# Altium schematic sheet VCU_Schematic.SchDoc
size A4; DocumentNumber: 4; SheetNumber: 4; SheetTotal: 8
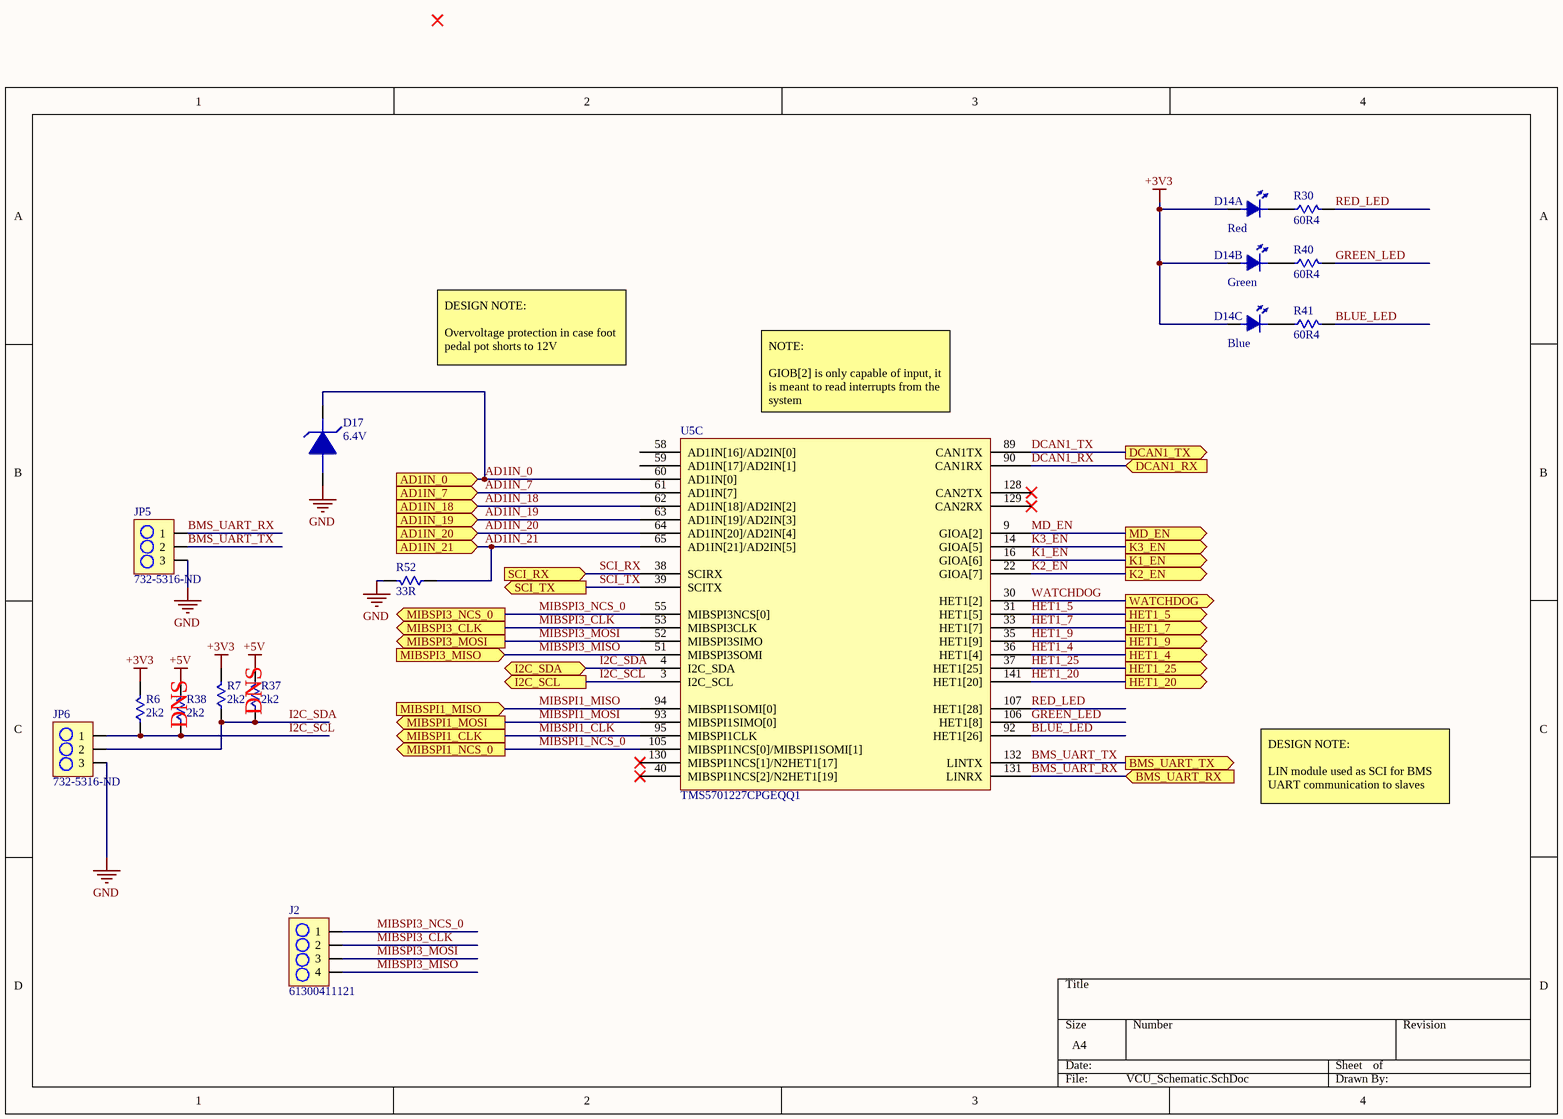
[diagram p0: VCU_Schematic.SchDoc]

## Parts
D14  EAST1616RGBB4  [LED_TRICOLOR]  (value not drawn)  (parts A,B,C of 3)
D17  6.4V  [DIODE_TVS]
J2  61300411121  [4PIN_HEADER]
JP5  732-5316-ND  [3PIN_HEADER]
JP6  732-5316-ND  [3PIN_HEADER]
R6  2k2  [R0402]
R7  2k2  [R0402]
R30  60R4  [R0402]
R37  2k2  [R0402]
R38  2k2  [R0402]
R40  60R4  [R0402]
R41  60R4  [R0402]
R52  33R  [R0805-3D]
U5  TMS5701227CPGEQQ1  [LQFP-144]  (part C of 3)

## Ports
AD1IN_0, AD1IN_7, AD1IN_18, AD1IN_19, AD1IN_20, AD1IN_21, BMS_UART_RX, BMS_UART_TX, DCAN1_RX, DCAN1_TX, HET1_4, HET1_5, HET1_7, HET1_9, HET1_20, HET1_25, I2C_SCL, I2C_SDA, K1_EN, K2_EN, K3_EN, MD_EN, MIBSPI1_CLK, MIBSPI1_MISO, MIBSPI1_MOSI, MIBSPI1_NCS_0, MIBSPI3_CLK, MIBSPI3_MISO, MIBSPI3_MOSI, MIBSPI3_NCS_0, SCI_RX, SCI_TX, WATCHDOG

## Nets
+3V3: D14.4 R6.2 R7.2
+5V: R37.2 R38.2
GND: D17.2 JP5.3 JP6.3 R52.2
AD1IN_0: D17.1 U5.60(AD1IN[0]) ; port AD1IN_0
AD1IN_7: U5.61(AD1IN[7]) ; port AD1IN_7
AD1IN_18: U5.62(AD1IN[18]/AD2IN[2]) ; port AD1IN_18
AD1IN_19: U5.63(AD1IN[19]/AD2IN[3]) ; port AD1IN_19
AD1IN_20: U5.64(AD1IN[20]/AD2IN[4]) ; port AD1IN_20
AD1IN_21: R52.1 U5.65(AD1IN[21]/AD2IN[5]) ; port AD1IN_21
BLUE_LED: R41.2 U5.92(HET1[26])
BMS_UART_RX: JP5.1 U5.131(LINRX) ; port BMS_UART_RX
BMS_UART_TX: JP5.2 U5.132(LINTX) ; port BMS_UART_TX
DCAN1_RX: U5.90(CAN1RX) ; port DCAN1_RX
DCAN1_TX: U5.89(CAN1TX) ; port DCAN1_TX
GREEN_LED: R40.2 U5.106(HET1[8])
HET1_4: U5.36(HET1[4]) ; port HET1_4
HET1_5: U5.31(HET1[5]) ; port HET1_5
HET1_7: U5.33(HET1[7]) ; port HET1_7
HET1_9: U5.35(HET1[9]) ; port HET1_9
HET1_20: U5.141(HET1[20]) ; port HET1_20
HET1_25: U5.37(HET1[25]) ; port HET1_25
I2C_SCL: JP6.1 R6.1 R38.1 U5.3(I2C_SCL) ; port I2C_SCL
I2C_SDA: JP6.2 R7.1 R37.1 U5.4(I2C_SDA) ; port I2C_SDA
K1_EN: U5.16(GIOA[6]) ; port K1_EN
K2_EN: U5.22(GIOA[7]) ; port K2_EN
K3_EN: U5.14(GIOA[5]) ; port K3_EN
MD_EN: U5.9(GIOA[2]) ; port MD_EN
MIBSPI1_CLK: U5.95(MIBSPI1CLK) ; port MIBSPI1_CLK
MIBSPI1_MISO: U5.94(MIBSPI1SOMI[0]) ; port MIBSPI1_MISO
MIBSPI1_MOSI: U5.93(MIBSPI1SIMO[0]) ; port MIBSPI1_MOSI
MIBSPI1_NCS_0: U5.105(MIBSPI1NCS[0]/MIBSPI1SOMI[1]) ; port MIBSPI1_NCS_0
MIBSPI3_CLK: J2.2 U5.53(MIBSPI3CLK) ; port MIBSPI3_CLK
MIBSPI3_MISO: J2.4 U5.51(MIBSPI3SOMI) ; port MIBSPI3_MISO
MIBSPI3_MOSI: J2.3 U5.52(MIBSPI3SIMO) ; port MIBSPI3_MOSI
MIBSPI3_NCS_0: J2.1 U5.55(MIBSPI3NCS[0]) ; port MIBSPI3_NCS_0
RED_LED: R30.2 U5.107(HET1[28])
SCI_RX: U5.38(SCIRX) ; port SCI_RX
SCI_TX: U5.39(SCITX) ; port SCI_TX
WATCHDOG: U5.30(HET1[2]) ; port WATCHDOG
NetD14_1: D14.1 R30.1
NetD14_2: D14.2 R40.1
NetD14_3: D14.3 R41.1

Not connected (* = marked no-connect by the designer): U5 40(MIBSPI1NCS[2]/N2HET1[19])* 58(AD1IN[16]/AD2IN[0]) 59(AD1IN[17]/AD2IN[1]) 128(CAN2TX)* 129(CAN2RX)* 130(MIBSPI1NCS[1]/N2HET1[17])*

## Notes on the sheet
- DESIGN NOTE:
  Overvoltage protection in case foot pedal pot shorts to 12V
- (near U5) NOTE:
  GIOB[2] is only capable of input, it is meant to read interrupts from the system
- (near R38) DNS
- (near R37) DNS
- DESIGN NOTE:
  LIN module used as SCI for BMS UART communication to slaves
- (in symbol EAST1616RGBB4, part A) Red
- (in symbol EAST1616RGBB4, part B) Green
- (in symbol EAST1616RGBB4, part C) Blue

## Library data of the parts
D14 = EAST1616RGBB4: LED TRICOLOR RED GREEN BLUE; Manufacturer: Everlight; Supplier 1: Digi-Key; Manufacturer Part Number: EAST1616RGBB4; Stock 1: 0; Supplier Part Number 1: 1080-1552-2-ND
D17 = SMAJ5.0A: DIODE TVS_6V4 5VWM 9.2VC SMA; Manufacturer: Littelfuse; Clamping Voltage: 9.2V; Polarity: Unidirectional; Power Dissipation: 400W; Voltage Rating (DC): 5V; Number of Elements: 1; Max Surge Current: 43.5A; Power Line Protection: No; Test Current: 10mA; Max Breakdown Voltage: 7V; Max Reverse Leakage Current: 800uA; Max Power Dissipation: 3.3W; Element Configuration: Single; Supplier 1: Digi-Key; Manufacturer Part Number: SMAJ5.0A; Stock 1: 78251; Pricing 1: 1=0.51, 10=0.359, 25=0.2948, 100=0.2359, 250=0.1716, 500=0.1394, 1000=0.1072, 2500=0.0965 (USD); Mount: Surface Mount; Number of Pins: 2; Min Operating Temperature: -65°C; Max Operating Temperature: 150°C; Direction: Unidirectional; Package Quantity: 5000; Operating Supply Voltage: 5V; Packaging: Tape and Reel; Reverse Breakdown Voltage: 6.4V; Number of Unidirectional Channels: 1; Reverse Standoff Voltage: 5V; Min Breakdown Voltage: 6.4V; Peak Pulse Power: 400W; Breakdown Voltage: 6.4V; Number of Channels: 1; Termination: SMD/SMT; Peak Pulse Current: 43.5A; Leakage Current: 800uA; Length: 4.5mm; Height: 2.087mm; Width: 2.79mm; Radiation Hardening: No; REACH SVHC: No SVHC; Lead Free: Lead Free; ComponentLink1URL: https://datasheet.ciiva.com/330/littelfuse-tvs-diode-smaj-datasheet-pdf-330724.pdf; ComponentLink1Description: https://datasheet.ciiva.com/330/littelfuse-tvs-diode-smaj-datasheet-pdf-330724.pdf; ComponentLink2URL: https://datasheet.ciiva.com/330/littelfuse-tvs-diode-smaj-datasheet-pdf-330725.pdf; ComponentLink2Description: https://datasheet.ciiva.com/330/littelfuse-tvs-diode-smaj-datasheet-pdf-330725.pdf; ComponentLink3URL: https://datasheet.ciiva.com/330/littelfuse-tvs-diode-smaj-datasheet-pdf-330726.pdf; ComponentLink3Description: https://datasheet.ciiva.com/330/littelfuse-tvs-diode-smaj-datasheet-pdf-330726.pdf; ComponentLink4URL: https://datasheet.ciiva.com/16380/littelfuse-tvs-diode-smaj-16380982.pdf; ComponentLink4Description: https://datasheet.ciiva.com/16380/littelfuse-tvs-diode-smaj-16380982.pdf; ComponentLink5URL: https://datasheet.ciiva.com/25624/0900766b810f4edb-25624839.pdf; ComponentLink5Description: https://datasheet.ciiva.com/25624/0900766b810f4edb-25624839.pdf; ComponentLink6URL: https://datasheet.ciiva.com/28473/607617-28473433.pdf; ComponentLink6Description: https://datasheet.ciiva.com/28473/607617-28473433.pdf; ComponentLink7URL: https://datasheet.ciiva.com/4507/littelfuse-tvs-diode-smaj-23503-4507964.pdf; ComponentLink7Description: https://datasheet.ciiva.com/4507/littelfuse-tvs-diode-smaj-23503-4507964.pdf; ComponentLink8URL: https://datasheet.ciiva.com/8062/littelfuse-tvs-diode-smaj-8062271.pdf; ComponentLink8Description: https://datasheet.ciiva.com/8062/littelfuse-tvs-diode-smaj-8062271.pdf; Supplier Part Number 1: SMAJ5.0ALFCT-ND
J2 = 61300411121: CONN_HeaderPins4pos WURTH ELEKTRONIK         61300411121            Board-To-Board Connector, Vertical, WR-PHD Series, Through Hole, Header, 4 Contacts, 2.54 mm; Manufacturer: Wurth Electronics; Number of Positions: 4; Gender: Male; Connector Type: Male Pin; Pitch: 0.1inch; Supplier 1: Digi-Key; Manufacturer Part Number: 61300411121; Stock 1: 35015; Pricing 1: 1=0.18, 10=0.153, 25=0.1272, 50=0.106, 100=0.096, 1000=0.088 (USD); Mount: Through Hole; Contact Plating: Gold; Contact Material: Copper; Color: Black; Number of Rows: 1; Packaging: Bulk; Termination: Solder; Number of Contacts: 4; Contact Mating Length: 0.236inch; REACH SVHC: Unknown; Lead Free: Lead Free; Supplier Part Number 1: 732-5317-ND
JP5 JP6 = 61300311121: CONN_HeaderPins3pos WURTH ELEKTRONIK Board-To-Board Connector, Vertical, WR-PHD Series, Through Hole, Header, 3 Contacts, 2.54 mm; Manufacturer: Wurth Electronics; Number of Positions: 3; Gender: Male; Connector Type: Male Pin; Pitch: 0.1inch; Supplier 1: Digi-Key; Manufacturer Part Number: 61300311121; Stock 1: 57026; Pricing 1: 1=0.13, 10=0.106, 25=0.088, 50=0.074, 100=0.067, 1000=0.061 (USD); Mount: Through Hole; Case/Package: 100; Contact Plating: Gold; Contact Material: Copper; Colour: Black; Number of Rows: 1; Packaging: Bulk; Termination: Solder; Number of Contacts: 3; Contact Mating Length: 0.236inch; REACH SVHC: Unknown; Lead Free: Lead Free; ComponentLink1URL: http://www.farnell.com/cad/1737268.pdf; ComponentLink1Description: http://www.farnell.com/cad/1737268.pdf; Supplier Part Number 1: 732-5316-ND
R6 R7 R37 R38 = RC0402JR-072K2L: RES SMD 2.2K OHM 5% 1/16W 0402; Manufacturer: Yageo; Resistance: 2.2kR; Power Rating: 63mW; Voltage Rating: 50V; Temperature Coefficient: 100ppm/°C; Supplier 1: Digi-Key; Manufacturer Part Number: RC0402JR-072K2L; Stock 1: 7890813; Pricing 1: 1=0.1, 10=0.018, 100=0.0073, 1000=0.0033, 2500=0.0029, 5000=0.0024 (USD); Case/Package: 0402; Weight: 2.3E-05oz; Case Code (Metric): 1005; Case Code (Imperial): 0402; Min Operating Temperature: -55°C; Max Operating Temperature: 155°C; Tolerance: 5%; Packaging: Tape and Reel; Composition: Thick Film; Termination: SMD/SMT; Military Standard: Not; Package Quantity: 1; Number of Terminations: 2; Max Power Dissipation: 63mW; Working Voltage: 50V; Features: Moisture Resistant; Length: 1mm; Height: 0.016inch; Depth: 0.5mm; Width: 0.02inch; REACH SVHC: Unknown; Lead Free: Lead Free; Supplier Part Number 1: 311-2.2KJRCT-ND
R30 R40 R41 = RMCF0402FT60R4: RES SMD 60.4 OHM 1% 0402 1/16W 100ppm/C Molded SMD SMD Paper T/R; Manufacturer: Stackpole Electronics; Resistance: 60.4R; Max Power Dissipation: 63mW; Temperature Coefficient: 100ppm/°C; Supplier 1: Digi-Key; Manufacturer Part Number: RMCF0402FT60R4; Stock 1: 29830; Pricing 1: 1=0.1, 10=0.016, 100=0.0064, 1000=0.0029, 2500=0.0025, 5000=0.0021 (USD); Mount: Surface Mount; Case/Package: 0402; Case Code (Metric): 1005; Case Code (Imperial): 0402; Contact Plating: Matte,Tin; Min Operating Temperature: -55°C; Max Operating Temperature: 155°C; Packaging: Tape and Reel; Tolerance: 1%; Composition: Thick Film; Number of Terminations: 2; Features: Automotive AEC-Q200; Length: 0.039inch; Height: 0.016inch; Width: 0.02inch; Radiation Hardening: No; Lead Free: Lead Free; Supplier Part Number 1: RMCF0402FT60R4CT-ND
R52 = ESR10EZPJ330: RES SMD 33 OHM 5% 0.4W 0805; Manufacturer: Rohm; Temperature Coefficient: 200ppm/°C; Max Power Dissipation: 400mW; Supplier 1: Digi-Key; Manufacturer Part Number: ESR10EZPJ330; Stock 1: 8927; Pricing 1: 1=0.1, 10=0.083, 100=0.0318, 1000=0.014, 2500=0.0121 (USD); Case/Package: 0805; Case Code (Metric): 2012; Case Code (Imperial): 0805; Min Operating Temperature: -55°C; Max Operating Temperature: 155°C; Package Quantity: 1; Resistance: 33R; Tolerance: 5%; Packaging: Tape and Reel; Composition: Thick Film; Number of Terminations: 2; Features: Automotive AEC-Q200; Power Rating: 400mW; Length: 0.079inch; Height: 0.026inch; Width: 0.049inch; Lead Free: Lead Free; ComponentLink1URL: http://www.rohm.com/web/global/datasheet/ESR01MZPF/esr-e?src-supplier=Digi-Key; ComponentLink1Description: http://www.rohm.com/web/global/datasheet/ESR01MZPF/esr-e?src-supplier=Digi-Key; ComponentLink2URL: https://www.rohm.com/datasheet/ESR01MZPF/esr-e?src-supplier=Digi-Key; ComponentLink2Description: https://www.rohm.com/datasheet/ESR01MZPF/esr-e?src-supplier=Digi-Key; ComponentLink3URL: http://www1.futureelectronics.com/doc/ROHM%20SEMICONDUCTOR/ESR10EZPD.pdf?src-supplier=Future+Electronics; ComponentLink3Description: http://www1.futureelectronics.com/doc/ROHM%20SEMICONDUCTOR/ESR10EZPD.pdf?src-supplier=Future+Electronics; Supplier Part Number 1: RHM33KCT-ND
U5 = TMS5701227CPGEQQ1: IC MCU 16-Bit/32-Bit Hercules TMS570 ARM Cortex R4F RISC 1280KB Flash 1.2V/3.3V 144-Pin LQFP; Manufacturer: Texas Instruments; Frequency: 160MHz; Interface: CAN,EBI/EMI,Ethernet,I2C,LIN,SCI,SPI,UART,USART; Number of I/Os: 58; Oscillator Type: External; RAM Size: 192KB; Number of Timers/Counters: 2; Watchdog Timer: Yes; Memory Size: 1.25MB; Density: 1310720B; Peripherals: DMA,POR,PWM,WDT; Supplier 1: Digi-Key; Manufacturer Part Number: TMS5701227CPGEQQ1; Stock 1: 2872; Pricing 1: 1=24.99, 10=23.046, 60=22.0098, 120=19.6794, 540=17.8669 (USD); Case/Package: LQFP; Number of Pins: 144; Min Operating Temperature: -40°C; Max Operating Temperature: 125°C; Packaging: Tray; Number of Programmable I/O: 58; Max Frequency: 160MHz; Memory Type: FLASH; Number of GPIO: 58; Core Architecture: ARM; Lead Free: Lead Free; Supplier Part Number 1: 296-42451-ND